# Altium project Alaska 2-1.PrjPcb
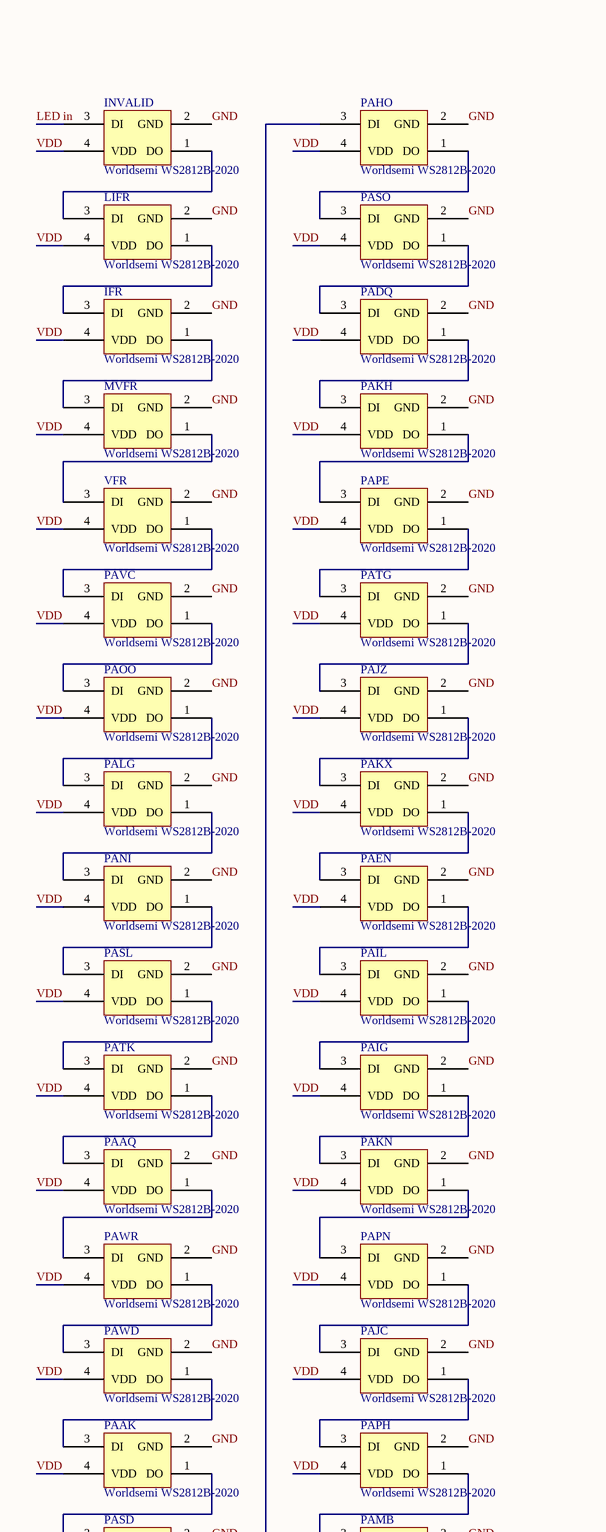
[diagram p0: Alaska 2-1.SchDoc, top left]
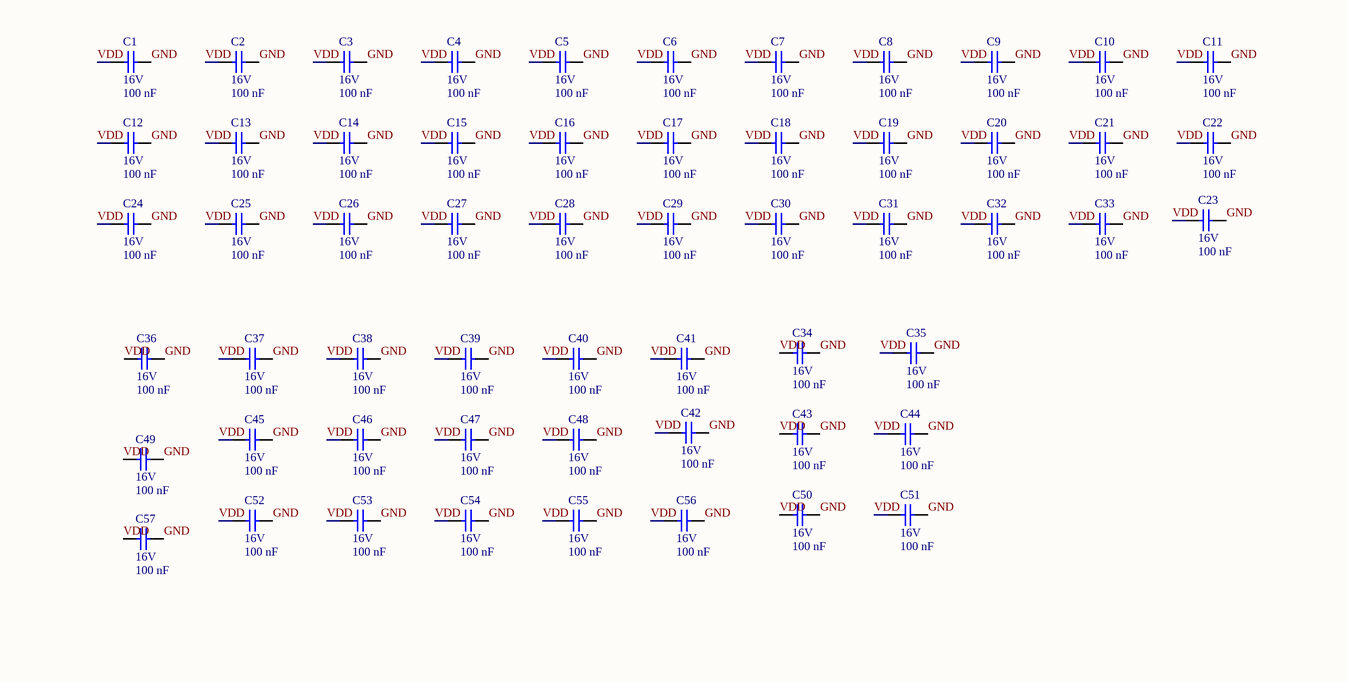
[diagram p1: Alaska 2-1.SchDoc, top middle]
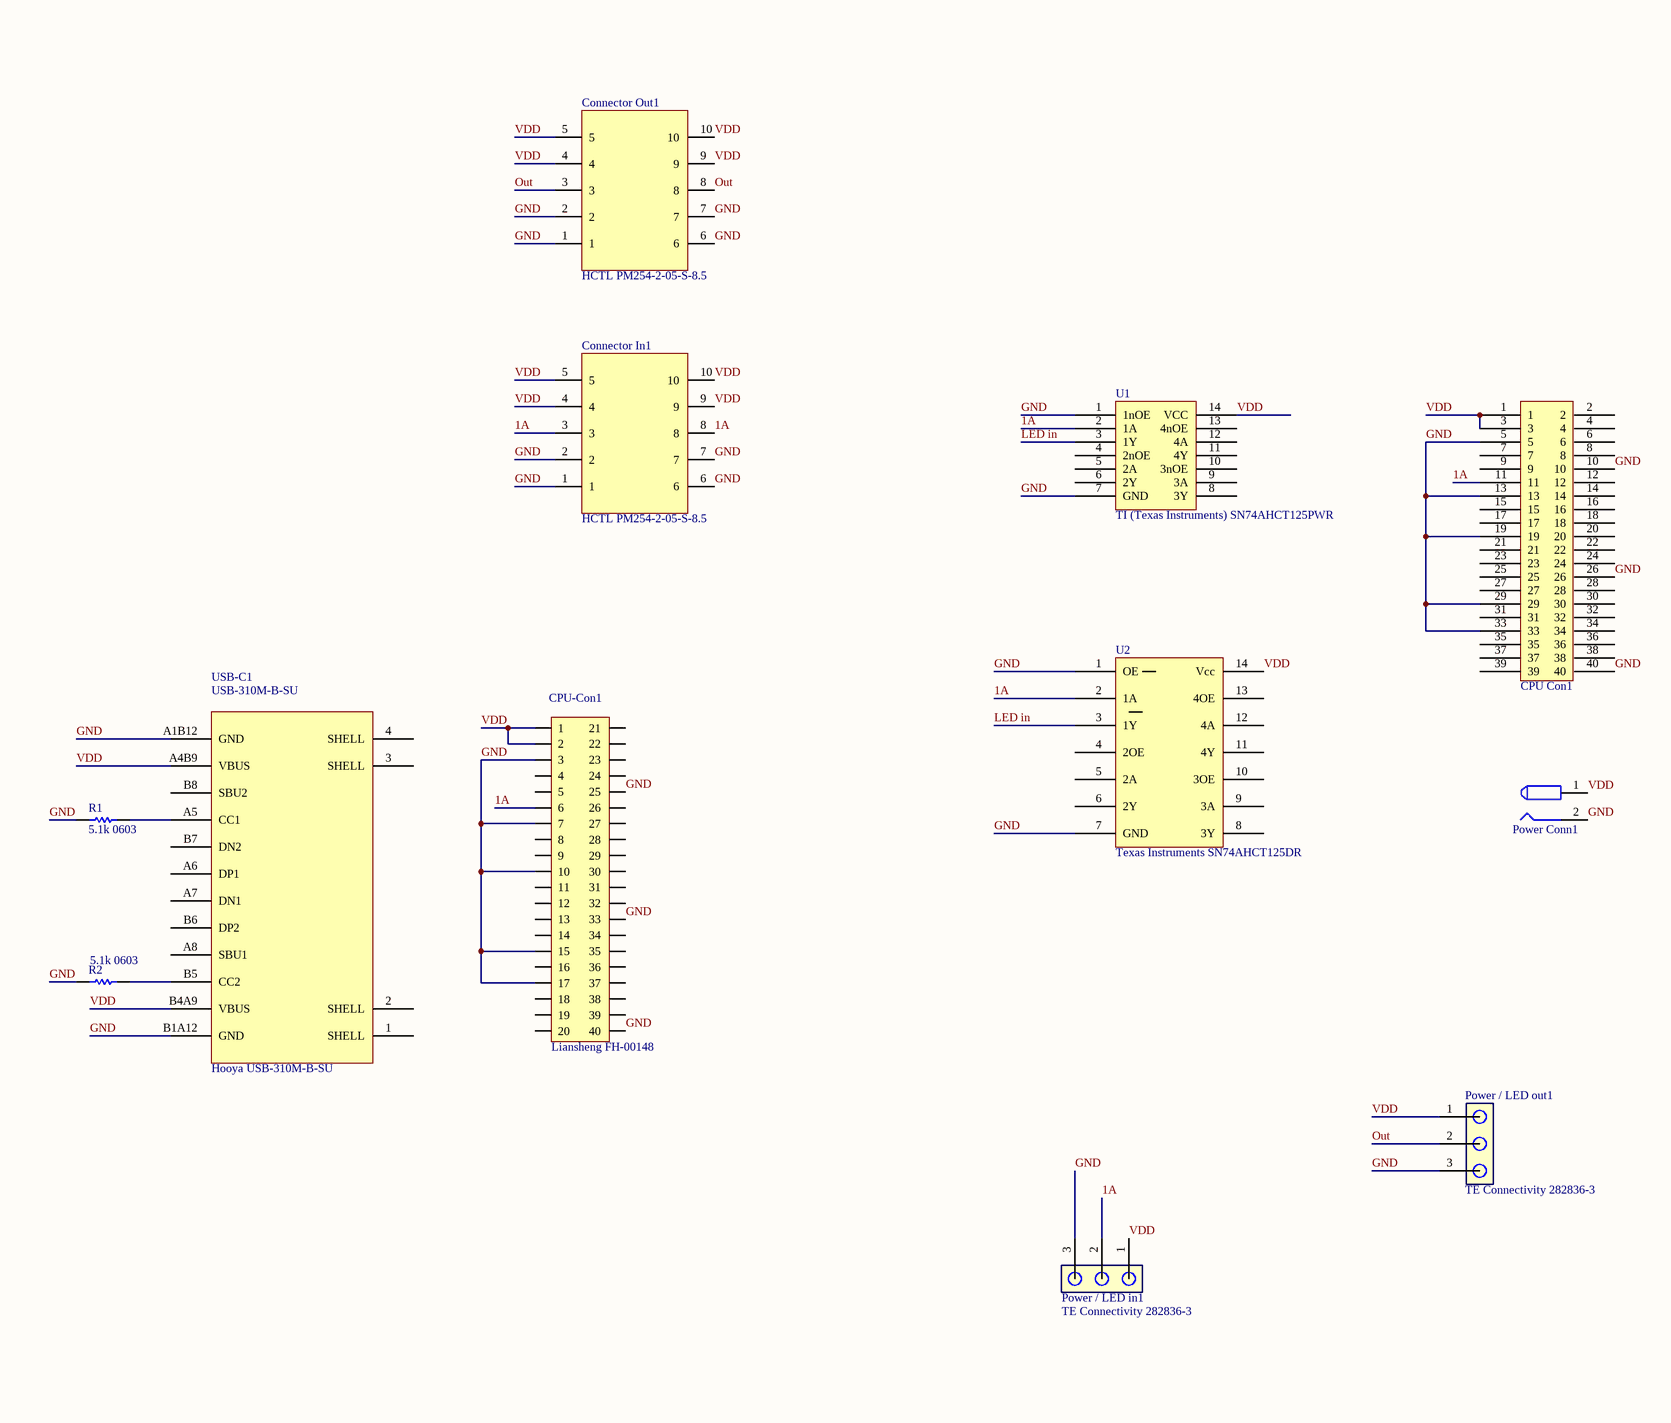
[diagram p2: Alaska 2-1.SchDoc, top right]
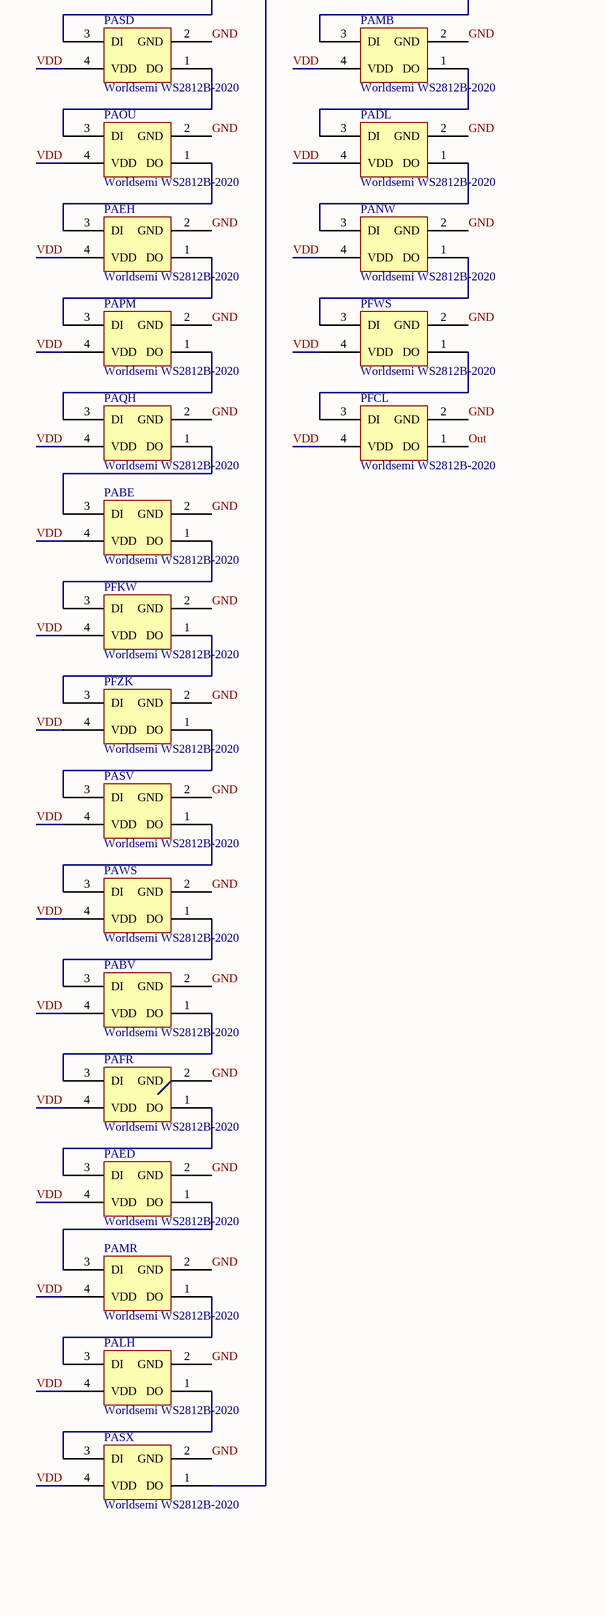
[diagram p3: Alaska 2-1.SchDoc, bottom left]
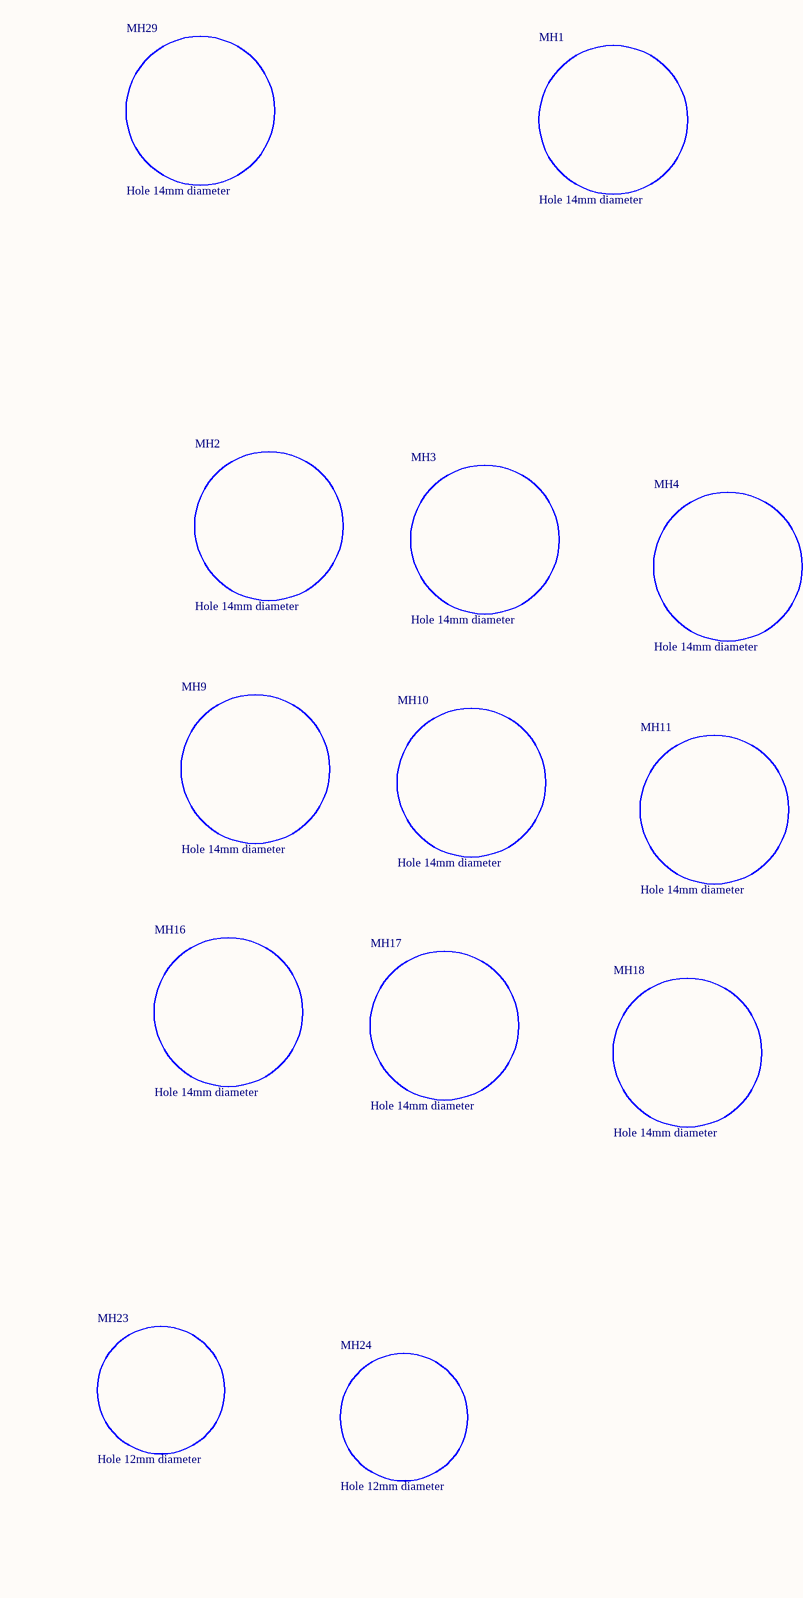
[diagram p4: Alaska 2-1.SchDoc, bottom middle]
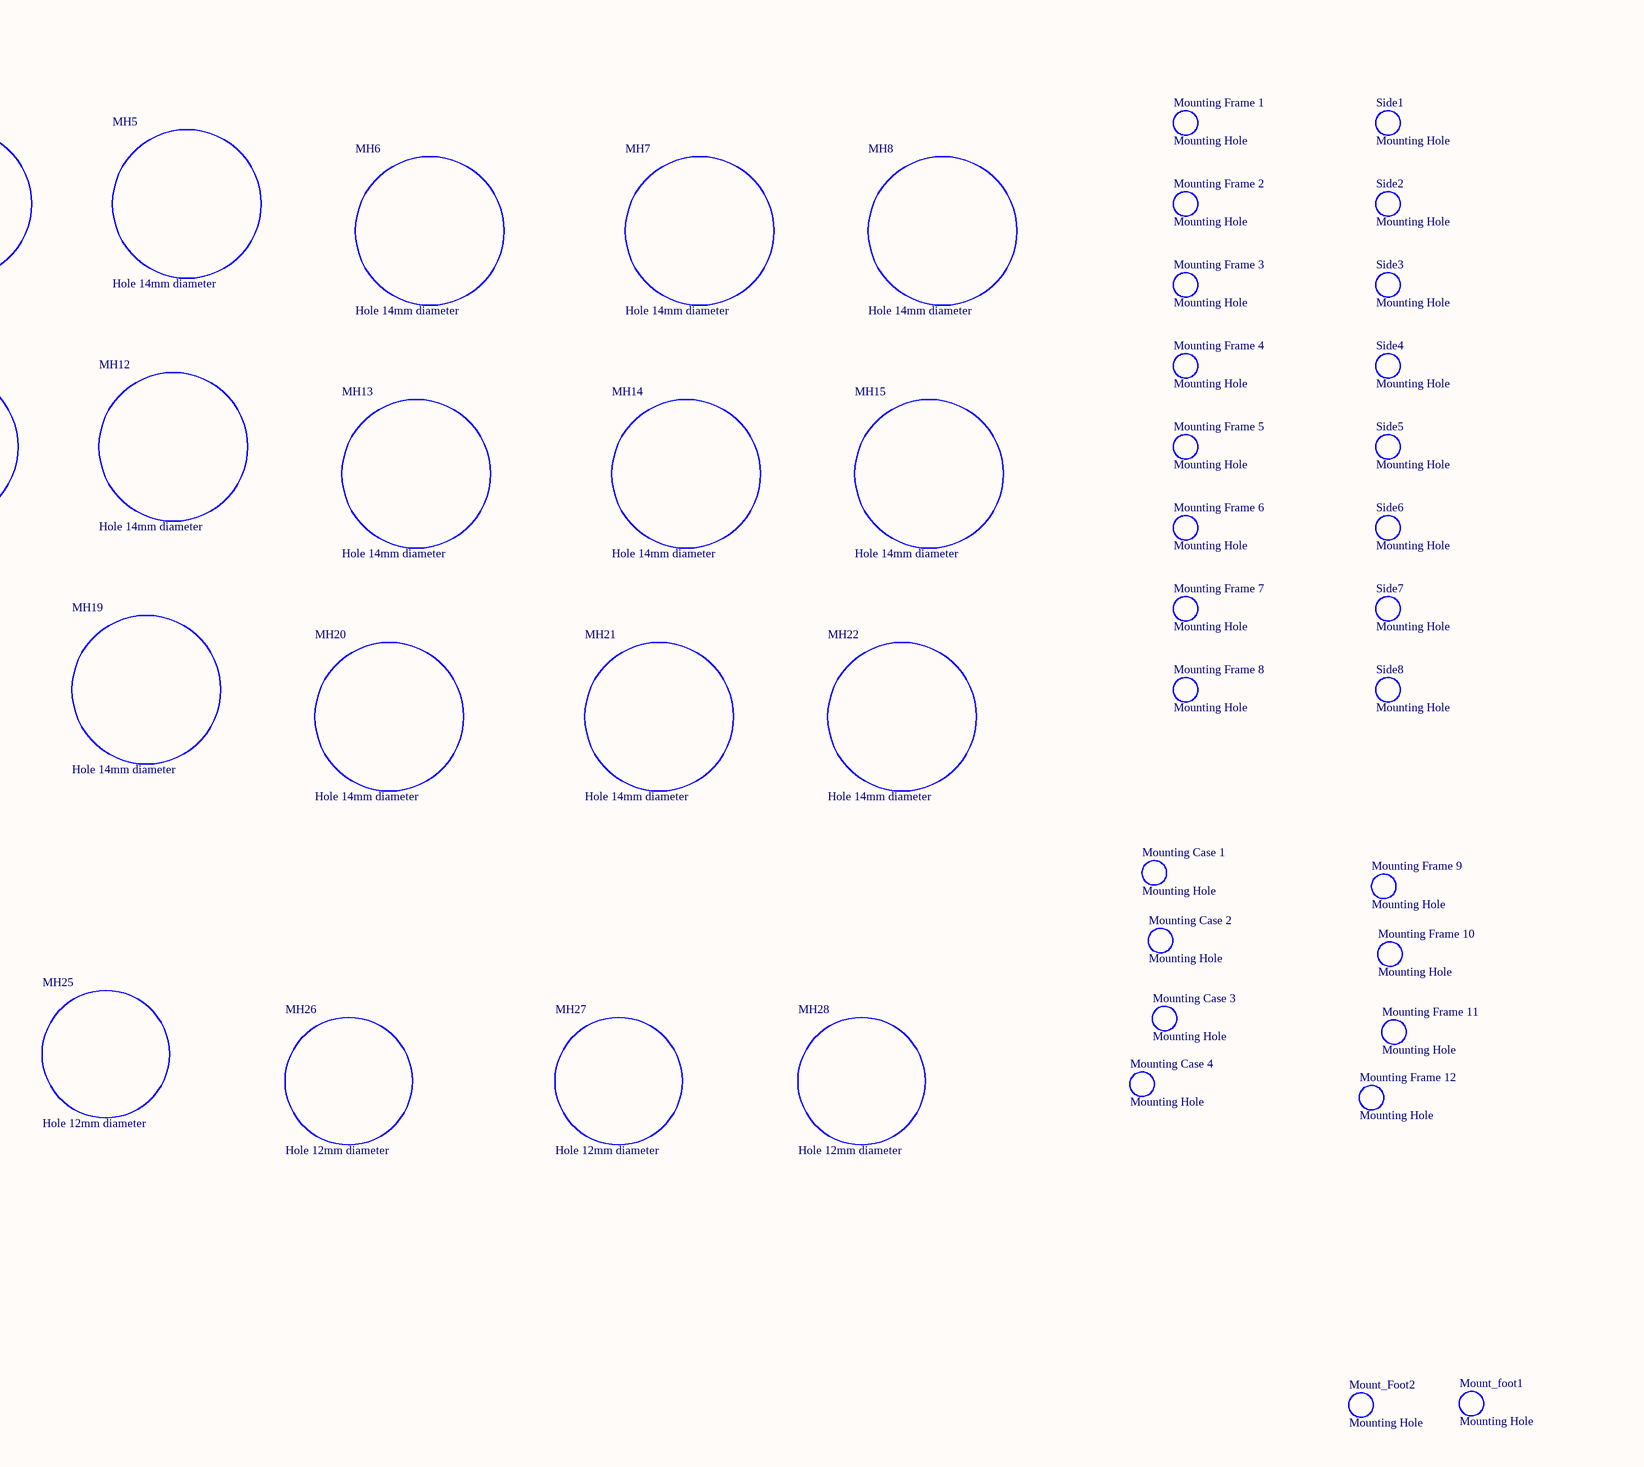
[diagram p5: Alaska 2-1.SchDoc, bottom right]
1 sheet, 175 parts. Net scope: global (net labels, ports and power ports of the same name join across sheets).
Board file: Alaska 2-1.PcbDoc

## Sheet Alaska 2-1.SchDoc
size A0; SheetNumber: 1; SheetTotal: 1

### Parts
C1  16V  Capacitance: 100 nF  [CAPC1005X56X25NL10T15]
C2  16V  Capacitance: 100 nF  [CAPC1005X56X25NL10T15]
C3  16V  Capacitance: 100 nF  [CAPC1005X56X25NL10T15]
C4  16V  Capacitance: 100 nF  [CAPC1005X56X25NL10T15]
C5  16V  Capacitance: 100 nF  [CAPC1005X56X25NL10T15]
C6  16V  Capacitance: 100 nF  [CAPC1005X56X25NL10T15]
C7  16V  Capacitance: 100 nF  [CAPC1005X56X25NL10T15]
C8  16V  Capacitance: 100 nF  [CAPC1005X56X25NL10T15]
C9  16V  Capacitance: 100 nF  [CAPC1005X56X25NL10T15]
C10  16V  Capacitance: 100 nF  [CAPC1005X56X25NL10T15]
C11  16V  Capacitance: 100 nF  [CAPC1005X56X25NL10T15]
C12  16V  Capacitance: 100 nF  [CAPC1005X56X25NL10T15]
C13  16V  Capacitance: 100 nF  [CAPC1005X56X25NL10T15]
C14  16V  Capacitance: 100 nF  [CAPC1005X56X25NL10T15]
C15  16V  Capacitance: 100 nF  [CAPC1005X56X25NL10T15]
C16  16V  Capacitance: 100 nF  [CAPC1005X56X25NL10T15]
C17  16V  Capacitance: 100 nF  [CAPC1005X56X25NL10T15]
C18  16V  Capacitance: 100 nF  [CAPC1005X56X25NL10T15]
C19  16V  Capacitance: 100 nF  [CAPC1005X56X25NL10T15]
C20  16V  Capacitance: 100 nF  [CAPC1005X56X25NL10T15]
C21  16V  Capacitance: 100 nF  [CAPC1005X56X25NL10T15]
C22  16V  Capacitance: 100 nF  [CAPC1005X56X25NL10T15]
C23  16V  Capacitance: 100 nF  [CAPC1005X56X25NL10T15]
C24  16V  Capacitance: 100 nF  [CAPC1005X56X25NL10T15]
C25  16V  Capacitance: 100 nF  [CAPC1005X56X25NL10T15]
C26  16V  Capacitance: 100 nF  [CAPC1005X56X25NL10T15]
C27  16V  Capacitance: 100 nF  [CAPC1005X56X25NL10T15]
C28  16V  Capacitance: 100 nF  [CAPC1005X56X25NL10T15]
C29  16V  Capacitance: 100 nF  [CAPC1005X56X25NL10T15]
C30  16V  Capacitance: 100 nF  [CAPC1005X56X25NL10T15]
C31  16V  Capacitance: 100 nF  [CAPC1005X56X25NL10T15]
C32  16V  Capacitance: 100 nF  [CAPC1005X56X25NL10T15]
C33  16V  Capacitance: 100 nF  [CAPC1005X56X25NL10T15]
C34  16V  Capacitance: 100 nF  [CAPC1005X56X25NL10T15]
C35  16V  Capacitance: 100 nF  [CAPC1005X56X25NL10T15]
C36  16V  Capacitance: 100 nF  [CAPC1005X56X25NL10T15]
C37  16V  Capacitance: 100 nF  [CAPC1005X56X25NL10T15]
C38  16V  Capacitance: 100 nF  [CAPC1005X56X25NL10T15]
C39  16V  Capacitance: 100 nF  [CAPC1005X56X25NL10T15]
C40  16V  Capacitance: 100 nF  [CAPC1005X56X25NL10T15]
C41  16V  Capacitance: 100 nF  [CAPC1005X56X25NL10T15]
C42  16V  Capacitance: 100 nF  [CAPC1005X56X25NL10T15]
C43  16V  Capacitance: 100 nF  [CAPC1005X56X25NL10T15]
C44  16V  Capacitance: 100 nF  [CAPC1005X56X25NL10T15]
C45  16V  Capacitance: 100 nF  [CAPC1005X56X25NL10T15]
C46  16V  Capacitance: 100 nF  [CAPC1005X56X25NL10T15]
C47  16V  Capacitance: 100 nF  [CAPC1005X56X25NL10T15]
C48  16V  Capacitance: 100 nF  [CAPC1005X56X25NL10T15]
C49  16V  Capacitance: 100 nF  [CAPC1005X56X25NL10T15]
C50  16V  Capacitance: 100 nF  [CAPC1005X56X25NL10T15]
C51  16V  Capacitance: 100 nF  [CAPC1005X56X25NL10T15]
C52  16V  Capacitance: 100 nF  [CAPC1005X56X25NL10T15]
C53  16V  Capacitance: 100 nF  [CAPC1005X56X25NL10T15]
C54  16V  Capacitance: 100 nF  [CAPC1005X56X25NL10T15]
C55  16V  Capacitance: 100 nF  [CAPC1005X56X25NL10T15]
C56  16V  Capacitance: 100 nF  [CAPC1005X56X25NL10T15]
C57  16V  Capacitance: 100 nF  [CAPC1005X56X25NL10T15]
Connector_In1  HCTL PM254-2-05-S-8.5  [PM254-2-05-S-8.5]
Connector_Out1  HCTL PM254-2-05-S-8.5  [PM254-2-05-S-8.5]
CPU-Con1  Liansheng FH-00148  [Liansheng_FH-00148_Footprint_01]
CPU_Con1  40 pin Female connector  [Harwin 40 pin Female]  (value not drawn)
IFR  Worldsemi WS2812B-2020  [PCB-18681qzhn4j348g96a9l-1]
INVALID  Worldsemi WS2812B-2020  [PCB-18681qzhn4j348g96a9l-1]
LIFR  Worldsemi WS2812B-2020  [PCB-18681qzhn4j348g96a9l-1]
MH1  Hole 14mm diameter  [Mounting Hole 14mm]
MH2  Hole 14mm diameter  [Mounting Hole 14mm]
MH3  Hole 14mm diameter  [Mounting Hole 14mm]
MH4  Hole 14mm diameter  [Mounting Hole 14mm]
MH5  Hole 14mm diameter  [Mounting Hole 14mm]
MH6  Hole 14mm diameter  [Mounting Hole 14mm]
MH7  Hole 14mm diameter  [Mounting Hole 14mm]
MH8  Hole 14mm diameter  [Mounting Hole 14mm]
MH9  Hole 14mm diameter  [Mounting Hole 14mm]
MH10  Hole 14mm diameter  [Mounting Hole 14mm]
MH11  Hole 14mm diameter  [Mounting Hole 14mm]
MH12  Hole 14mm diameter  [Mounting Hole 14mm]
MH13  Hole 14mm diameter  [Mounting Hole 14mm]
MH14  Hole 14mm diameter  [Mounting Hole 14mm]
MH15  Hole 14mm diameter  [Mounting Hole 14mm]
MH16  Hole 14mm diameter  [Mounting Hole 14mm]
MH17  Hole 14mm diameter  [Mounting Hole 14mm]
MH18  Hole 14mm diameter  [Mounting Hole 14mm]
MH19  Hole 14mm diameter  [Mounting Hole 14mm]
MH20  Hole 14mm diameter  [Mounting Hole 14mm]
MH21  Hole 14mm diameter  [Mounting Hole 14mm]
MH22  Hole 14mm diameter  [Mounting Hole 14mm]
MH23  Hole 12mm diameter  [Mounting Hole 12mm]
MH24  Hole 12mm diameter  [Mounting Hole 12mm]
MH25  Hole 12mm diameter  [Mounting Hole 12mm]
MH26  Hole 12mm diameter  [Mounting Hole 12mm]
MH27  Hole 12mm diameter  [Mounting Hole 12mm]
MH28  Hole 12mm diameter  [Mounting Hole 12mm]
MH29  Hole 14mm diameter  [Mounting Hole 14mm]
Mount_foot1  Mounting Hole  [PCB-q0vxx67e01kaxtvhakkm-1]
Mount_Foot2  Mounting Hole  [PCB-q0vxx67e01kaxtvhakkm-1]
Mounting_Case_1  Mounting Hole  [PCB-q0vxx67e01kaxtvhakkm-1]
Mounting_Case_2  Mounting Hole  [PCB-q0vxx67e01kaxtvhakkm-1]
Mounting_Case_3  Mounting Hole  [PCB-q0vxx67e01kaxtvhakkm-1]
Mounting_Case_4  Mounting Hole  [PCB-q0vxx67e01kaxtvhakkm-1]
Mounting_Frame_1  Mounting Hole  [PCB-q0vxx67e01kaxtvhakkm-1]
Mounting_Frame_2  Mounting Hole  [PCB-q0vxx67e01kaxtvhakkm-1]
Mounting_Frame_3  Mounting Hole  [PCB-q0vxx67e01kaxtvhakkm-1]
Mounting_Frame_4  Mounting Hole  [PCB-q0vxx67e01kaxtvhakkm-1]
Mounting_Frame_5  Mounting Hole  [PCB-q0vxx67e01kaxtvhakkm-1]
Mounting_Frame_6  Mounting Hole  [PCB-q0vxx67e01kaxtvhakkm-1]
Mounting_Frame_7  Mounting Hole  [PCB-q0vxx67e01kaxtvhakkm-1]
Mounting_Frame_8  Mounting Hole  [PCB-q0vxx67e01kaxtvhakkm-1]
Mounting_Frame_9  Mounting Hole  [PCB-q0vxx67e01kaxtvhakkm-1]
Mounting_Frame_10  Mounting Hole  [PCB-q0vxx67e01kaxtvhakkm-1]
Mounting_Frame_11  Mounting Hole  [PCB-q0vxx67e01kaxtvhakkm-1]
Mounting_Frame_12  Mounting Hole  [PCB-q0vxx67e01kaxtvhakkm-1]
MVFR  Worldsemi WS2812B-2020  [PCB-18681qzhn4j348g96a9l-1]
PAAK  Worldsemi WS2812B-2020  [PCB-18681qzhn4j348g96a9l-1]
PAAQ  Worldsemi WS2812B-2020  [PCB-18681qzhn4j348g96a9l-1]
PABE  Worldsemi WS2812B-2020  [PCB-18681qzhn4j348g96a9l-1]
PABV  Worldsemi WS2812B-2020  [PCB-18681qzhn4j348g96a9l-1]
PADL  Worldsemi WS2812B-2020  [PCB-18681qzhn4j348g96a9l-1]
PADQ  Worldsemi WS2812B-2020  [PCB-18681qzhn4j348g96a9l-1]
PAED  Worldsemi WS2812B-2020  [PCB-18681qzhn4j348g96a9l-1]
PAEH  Worldsemi WS2812B-2020  [PCB-18681qzhn4j348g96a9l-1]
PAEN  Worldsemi WS2812B-2020  [PCB-18681qzhn4j348g96a9l-1]
PAFR  Worldsemi WS2812B-2020  [PCB-18681qzhn4j348g96a9l-1]
PAHO  Worldsemi WS2812B-2020  [PCB-18681qzhn4j348g96a9l-1]
PAIG  Worldsemi WS2812B-2020  [PCB-18681qzhn4j348g96a9l-1]
PAIL  Worldsemi WS2812B-2020  [PCB-18681qzhn4j348g96a9l-1]
PAJC  Worldsemi WS2812B-2020  [PCB-18681qzhn4j348g96a9l-1]
PAJZ  Worldsemi WS2812B-2020  [PCB-18681qzhn4j348g96a9l-1]
PAKH  Worldsemi WS2812B-2020  [PCB-18681qzhn4j348g96a9l-1]
PAKN  Worldsemi WS2812B-2020  [PCB-18681qzhn4j348g96a9l-1]
PAKX  Worldsemi WS2812B-2020  [PCB-18681qzhn4j348g96a9l-1]
PALG  Worldsemi WS2812B-2020  [PCB-18681qzhn4j348g96a9l-1]
PALH  Worldsemi WS2812B-2020  [PCB-18681qzhn4j348g96a9l-1]
PAMB  Worldsemi WS2812B-2020  [PCB-18681qzhn4j348g96a9l-1]
PAMR  Worldsemi WS2812B-2020  [PCB-18681qzhn4j348g96a9l-1]
PANI  Worldsemi WS2812B-2020  [PCB-18681qzhn4j348g96a9l-1]
PANW  Worldsemi WS2812B-2020  [PCB-18681qzhn4j348g96a9l-1]
PAOO  Worldsemi WS2812B-2020  [PCB-18681qzhn4j348g96a9l-1]
PAOU  Worldsemi WS2812B-2020  [PCB-18681qzhn4j348g96a9l-1]
PAPE  Worldsemi WS2812B-2020  [PCB-18681qzhn4j348g96a9l-1]
PAPH  Worldsemi WS2812B-2020  [PCB-18681qzhn4j348g96a9l-1]
PAPM  Worldsemi WS2812B-2020  [PCB-18681qzhn4j348g96a9l-1]
PAPN  Worldsemi WS2812B-2020  [PCB-18681qzhn4j348g96a9l-1]
PAQH  Worldsemi WS2812B-2020  [PCB-18681qzhn4j348g96a9l-1]
PASD  Worldsemi WS2812B-2020  [PCB-18681qzhn4j348g96a9l-1]
PASL  Worldsemi WS2812B-2020  [PCB-18681qzhn4j348g96a9l-1]
PASO  Worldsemi WS2812B-2020  [PCB-18681qzhn4j348g96a9l-1]
PASV  Worldsemi WS2812B-2020  [PCB-18681qzhn4j348g96a9l-1]
PASX  Worldsemi WS2812B-2020  [PCB-18681qzhn4j348g96a9l-1]
PATG  Worldsemi WS2812B-2020  [PCB-18681qzhn4j348g96a9l-1]
PATK  Worldsemi WS2812B-2020  [PCB-18681qzhn4j348g96a9l-1]
PAVC  Worldsemi WS2812B-2020  [PCB-18681qzhn4j348g96a9l-1]
PAWD  Worldsemi WS2812B-2020  [PCB-18681qzhn4j348g96a9l-1]
PAWR  Worldsemi WS2812B-2020  [PCB-18681qzhn4j348g96a9l-1]
PAWS  Worldsemi WS2812B-2020  [PCB-18681qzhn4j348g96a9l-1]
PFCL  Worldsemi WS2812B-2020  [PCB-18681qzhn4j348g96a9l-1]
PFKW  Worldsemi WS2812B-2020  [PCB-18681qzhn4j348g96a9l-1]
PFWS  Worldsemi WS2812B-2020  [PCB-18681qzhn4j348g96a9l-1]
PFZK  Worldsemi WS2812B-2020  [PCB-18681qzhn4j348g96a9l-1]
Power_/_LED_in1  TE Connectivity 282836-3  [282836-3]
Power_/_LED_out1  TE Connectivity 282836-3  [282836-3]
Power_Conn1  CMP-330397-12  [PCB-h5dulpljww4oyv25n50t-1]  (value not drawn)
R1  5.1k 0603  [CAPC1608X90X35NL15T15]
R2  5.1k 0603  [CAPC1608X90X35NL15T15]
Side1  Mounting Hole  [PCB-q0vxx67e01kaxtvhakkm-1]
Side2  Mounting Hole  [PCB-q0vxx67e01kaxtvhakkm-1]
Side3  Mounting Hole  [PCB-q0vxx67e01kaxtvhakkm-1]
Side4  Mounting Hole  [PCB-q0vxx67e01kaxtvhakkm-1]
Side5  Mounting Hole  [PCB-q0vxx67e01kaxtvhakkm-1]
Side6  Mounting Hole  [PCB-q0vxx67e01kaxtvhakkm-1]
Side7  Mounting Hole  [PCB-q0vxx67e01kaxtvhakkm-1]
Side8  Mounting Hole  [PCB-q0vxx67e01kaxtvhakkm-1]
U1  TI (Texas Instruments) SN74AHCT125PWR  [PCB-19361381-1]
U2  Texas Instruments SN74AHCT125DR  [PCB-4n9l8bvb0hxmq9svv09s-1]
USB-C1  Hooya USB-310M-B-SU  [Hooya USB-310M-B-SU-Footprint-1]
VFR  Worldsemi WS2812B-2020  [PCB-18681qzhn4j348g96a9l-1]

### Nets
1A: Connector_In1.3 Connector_In1.8 CPU-Con1.6 CPU_Con1.11 Power_/_LED_in1.2 U1.2(1A) U2.2(1A)
GND: C1.2 C2.2 C3.2 C4.2 C5.2 C6.2 C7.2 C8.2 C9.2 C10.2 C11.2 C12.2 C13.2 C14.2 C15.2 C16.2 C17.2 C18.2 C19.2 C20.2 C21.2 C22.2 C23.2 C24.2 C25.2 C26.2 C27.2 C28.2 C29.2 C30.2 C31.2 C32.2 C33.2 C34.2 C35.2 C36.2 C37.2 C38.2 C39.2 C40.2 C41.2 C42.2 C43.2 C44.2 C45.2 C46.2 C47.2 C48.2 C49.2 C50.2 C51.2 C52.2 C53.2 C54.2 C55.2 C56.2 C57.2 Connector_In1.1 Connector_In1.2 Connector_In1.6 Connector_In1.7 Connector_Out1.1 Connector_Out1.2 Connector_Out1.6 Connector_Out1.7 CPU-Con1.3 CPU-Con1.7 CPU-Con1.10 CPU-Con1.15 CPU-Con1.17 CPU-Con1.25 CPU-Con1.33 CPU-Con1.40 CPU_Con1.5 CPU_Con1.10 CPU_Con1.13 CPU_Con1.19 CPU_Con1.26 CPU_Con1.29 CPU_Con1.33 CPU_Con1.40 IFR.2(GND) INVALID.2(GND) LIFR.2(GND) MVFR.2(GND) PAAK.2(GND) PAAQ.2(GND) PABE.2(GND) PABV.2(GND) PADL.2(GND) PADQ.2(GND) PAED.2(GND) PAEH.2(GND) PAEN.2(GND) PAFR.2(GND) PAHO.2(GND) PAIG.2(GND) PAIL.2(GND) PAJC.2(GND) PAJZ.2(GND) PAKH.2(GND) PAKN.2(GND) PAKX.2(GND) PALG.2(GND) PALH.2(GND) PAMB.2(GND) PAMR.2(GND) PANI.2(GND) PANW.2(GND) PAOO.2(GND) PAOU.2(GND) PAPE.2(GND) PAPH.2(GND) PAPM.2(GND) PAPN.2(GND) PAQH.2(GND) PASD.2(GND) PASL.2(GND) PASO.2(GND) PASV.2(GND) PASX.2(GND) PATG.2(GND) PATK.2(GND) PAVC.2(GND) PAWD.2(GND) PAWR.2(GND) PAWS.2(GND) PFCL.2(GND) PFKW.2(GND) PFWS.2(GND) PFZK.2(GND) Power_/_LED_in1.3 Power_/_LED_out1.3 Power_Conn1.2(NEG) R1.1 R2.1 U1.1(1nOE) U1.7(GND) U2.1(OE) U2.7(GND) USB-C1.A1B12(GND) USB-C1.B1A12(GND) VFR.2(GND)
LED in: INVALID.3(DI) U1.3(1Y) U2.3(1Y)
Out: Connector_Out1.3 Connector_Out1.8 PFCL.1(DO) Power_/_LED_out1.2
VDD: C1.1 C2.1 C3.1 C4.1 C5.1 C6.1 C7.1 C8.1 C9.1 C10.1 C11.1 C12.1 C13.1 C14.1 C15.1 C16.1 C17.1 C18.1 C19.1 C20.1 C21.1 C22.1 C23.1 C24.1 C25.1 C26.1 C27.1 C28.1 C29.1 C30.1 C31.1 C32.1 C33.1 C34.1 C35.1 C36.1 C37.1 C38.1 C39.1 C40.1 C41.1 C42.1 C43.1 C44.1 C45.1 C46.1 C47.1 C48.1 C49.1 C50.1 C51.1 C52.1 C53.1 C54.1 C55.1 C56.1 C57.1 Connector_In1.4 Connector_In1.5 Connector_In1.9 Connector_In1.10 Connector_Out1.4 Connector_Out1.5 Connector_Out1.9 Connector_Out1.10 CPU-Con1.1 CPU-Con1.2 CPU_Con1.1 CPU_Con1.3 IFR.4(VDD) INVALID.4(VDD) LIFR.4(VDD) MVFR.4(VDD) PAAK.4(VDD) PAAQ.4(VDD) PABE.4(VDD) PABV.4(VDD) PADL.4(VDD) PADQ.4(VDD) PAED.4(VDD) PAEH.4(VDD) PAEN.4(VDD) PAFR.4(VDD) PAHO.4(VDD) PAIG.4(VDD) PAIL.4(VDD) PAJC.4(VDD) PAJZ.4(VDD) PAKH.4(VDD) PAKN.4(VDD) PAKX.4(VDD) PALG.4(VDD) PALH.4(VDD) PAMB.4(VDD) PAMR.4(VDD) PANI.4(VDD) PANW.4(VDD) PAOO.4(VDD) PAOU.4(VDD) PAPE.4(VDD) PAPH.4(VDD) PAPM.4(VDD) PAPN.4(VDD) PAQH.4(VDD) PASD.4(VDD) PASL.4(VDD) PASO.4(VDD) PASV.4(VDD) PASX.4(VDD) PATG.4(VDD) PATK.4(VDD) PAVC.4(VDD) PAWD.4(VDD) PAWR.4(VDD) PAWS.4(VDD) PFCL.4(VDD) PFKW.4(VDD) PFWS.4(VDD) PFZK.4(VDD) Power_/_LED_in1.1 Power_/_LED_out1.1 Power_Conn1.1(POS) U1.14(VCC) U2.14(Vcc) USB-C1.A4B9(VBUS) USB-C1.B4A9(VBUS) VFR.4(VDD)
NetIFR_1: IFR.1(DO) MVFR.3(DI)
NetIFR_3: IFR.3(DI) LIFR.1(DO)
NetINVALID_1: INVALID.1(DO) LIFR.3(DI)
NetMVFR_1: MVFR.1(DO) VFR.3(DI)
NetPAAK_1: PAAK.1(DO) PASD.3(DI)
NetPAAK_3: PAAK.3(DI) PAWD.1(DO)
NetPAAQ_1: PAAQ.1(DO) PAWR.3(DI)
NetPAAQ_3: PAAQ.3(DI) PATK.1(DO)
NetPABE_1: PABE.1(DO) PFKW.3(DI)
NetPABE_3: PABE.3(DI) PAQH.1(DO)
NetPABV_1: PABV.1(DO) PAFR.3(DI)
NetPABV_3: PABV.3(DI) PAWS.1(DO)
NetPADL_1: PADL.1(DO) PANW.3(DI)
NetPADL_3: PADL.3(DI) PAMB.1(DO)
NetPADQ_1: PADQ.1(DO) PAKH.3(DI)
NetPADQ_3: PADQ.3(DI) PASO.1(DO)
NetPAED_1: PAED.1(DO) PAMR.3(DI)
NetPAED_3: PAED.3(DI) PAFR.1(DO)
NetPAEH_1: PAEH.1(DO) PAPM.3(DI)
NetPAEH_3: PAEH.3(DI) PAOU.1(DO)
NetPAEN_1: PAEN.1(DO) PAIL.3(DI)
NetPAEN_3: PAEN.3(DI) PAKX.1(DO)
NetPAHO_1: PAHO.1(DO) PASO.3(DI)
NetPAHO_3: PAHO.3(DI) PASX.1(DO)
NetPAIG_1: PAIG.1(DO) PAKN.3(DI)
NetPAIG_3: PAIG.3(DI) PAIL.1(DO)
NetPAJC_1: PAJC.1(DO) PAPH.3(DI)
NetPAJC_3: PAJC.3(DI) PAPN.1(DO)
NetPAJZ_1: PAJZ.1(DO) PAKX.3(DI)
NetPAJZ_3: PAJZ.3(DI) PATG.1(DO)
NetPAKH_1: PAKH.1(DO) PAPE.3(DI)
NetPAKN_1: PAKN.1(DO) PAPN.3(DI)
NetPALG_1: PALG.1(DO) PANI.3(DI)
NetPALG_3: PALG.3(DI) PAOO.1(DO)
NetPALH_1: PALH.1(DO) PASX.3(DI)
NetPALH_3: PALH.3(DI) PAMR.1(DO)
NetPAMB_3: PAMB.3(DI) PAPH.1(DO)
NetPANI_1: PANI.1(DO) PASL.3(DI)
NetPANW_1: PANW.1(DO) PFWS.3(DI)
NetPAOO_3: PAOO.3(DI) PAVC.1(DO)
NetPAOU_3: PAOU.3(DI) PASD.1(DO)
NetPAPE_1: PAPE.1(DO) PATG.3(DI)
NetPAPM_1: PAPM.1(DO) PAQH.3(DI)
NetPASL_1: PASL.1(DO) PATK.3(DI)
NetPASV_1: PASV.1(DO) PAWS.3(DI)
NetPASV_3: PASV.3(DI) PFZK.1(DO)
NetPAVC_3: PAVC.3(DI) VFR.1(DO)
NetPAWD_3: PAWD.3(DI) PAWR.1(DO)
NetPFCL_3: PFCL.3(DI) PFWS.1(DO)
NetPFKW_1: PFKW.1(DO) PFZK.3(DI)
NetR1_2: R1.2 USB-C1.A5(CC1)
NetR2_2: R2.2 USB-C1.B5(CC2)

Not connected (* = marked no-connect by the designer): CPU-Con1 4 5 8 9 11 12 13 14 16 18 19 20 21 22 23 24 26 27 28 29 30 31 32 34 35 36 37 38 39; CPU_Con1 2 4 6 7 8 9 12 14 15 16 17 18 20 21 22 23 24 25 27 28 30 31 32 34 35 36 37 38 39; U1 4(2nOE) 5(2A) 6(2Y) 8(3Y) 9(3A) 10(3nOE) 11(4Y) 12(4A) 13(4nOE); U2 4(2OE) 5(2A) 6(2Y) 8(3Y) 9(3A) 10(3OE) 11(4Y) 12(4A) 13(4OE); USB-C1 1(SHELL) 2(SHELL) 3(SHELL) 4(SHELL) A6(DP1) A7(DN1) A8(SBU1) B6(DP2) B7(DN2) B8(SBU2)

### Library data of the parts
C1-C57 = CMP-bf2276a55d9a60e5-20: Generic CAP 0402, =Capacitance+','+Tolerance+','+Voltage+','+Dielectric+','+Case; Manufacturer Part Number: TBD; Lead-Free Status: Lead Free; Voltage: 25V; Dielectric: CGO; Tolerance: ±10%; Octopart URL: TBD; Case: 0402; OctopartID: 0755ced2c795d892; RoHS: Compliant; Mounting Style: Surface Mount; Footprint: PCB-0002-00476-3
Connector_In1 Connector_Out1 = PM254-2-05-S-8.5: 2.54mm 2.54mm 260℃@5S 3A -40℃~+105℃ Copper Alloy 10P Brick nogging 2x5P Top 8.5mm Square Hole SMD,P=2.54mm Female Headers ROHS; ComponentLink1Description: New link; ComponentLink1URL: https://www.lcsc.com/product-detail/Female-Headers_HCTL-PM254-2-05-S-8-5_C3975150.html
CPU-Con1 = CMP-xf5hfsu41fuj64nwsg7i-2: 2.54mm 2.54mm 3A Gold Brass -40℃~+105℃ 260℃@10S Brick nogging 2x20P 7.1mm Top 40 Square Holes SMD,P=2.54mm Female Headers ROHS; ComponentLink1Description: Website; ComponentLink1URL: https://www.lcsc.com/product-detail/Female-Headers_Liansheng-FH-00148_C2685092.html; CustomComponentID: xf5hfsu41fuj64nwsg7i
CPU_Con1 = CMP-2482621-16: 2.54mm (0.1") Pitch DIL Vertical PC Tail Socket Assembly, tin, 20+20 contacts
IFR INVALID LIFR MVFR PAAK PAAQ PABE PABV PADL PADQ PAED PAEH PAEN PAFR PAHO PAIG PAIL PAJC PAJZ PAKH PAKN PAKX PALG PALH PAMB PAMR PANI PANW PAOO PAOU PAPE PAPH PAPM PAPN PAQH PASD PASL PASO PASV PASX PATG PATK PAVC PAWD PAWR PAWS PFCL PFKW PFWS PFZK VFR = CMP-30b1feb25fa9ef76-6: Manufacturer Part Number: WS2812B-2020; Octopart URL: https://octopart.com/ws2812b-2020-worldsemi-118049406; OctopartID: 30b1feb25fa9ef76
MH1-MH22 MH29 = Mounting Hole 14mm: Hole for mounting
MH23-MH28 = Mounting Hole 12mm: Hole for mounting
Mount_foot1 Mount_Foot2 Mounting_Case_1-Mounting_Case_4 Mounting_Frame_1-Mounting_Frame_12 Side1-Side8 = CMP-q3gk3wg8yin1w7wp8pag-1: Mounting Hole 3.5mm; CustomComponentID: q3gk3wg8yin1w7wp8pag
Power_/_LED_in1 Power_/_LED_out1 = CMP-d7c21c93a45c0805-15: Conn; Term Blk; Wire Receptacle; 3; 5 mm; 30-16 AWG; Green; 13.5 A; 300 V; Number of Contacts: 3; Lead-Free Status: Lead Free; Pin Pitch: 5.00 mm; Wire Gauge: 15.0 AWG; Voltage Rating (AC): 250 V; Current Rating: 13.5 A; ELV Compliant: Compliant; Octopart URL: http://octopart.com/282836-3-te+connectivity-39540472; Manufacturer Part Number: 282836-3; Housing Material: Nylon 6/6; Housing Color: Green; RoHS: Compliant; Orientation: Right Angle; Mounting Style: PCB; Number of Positions: 3; Insulation Material: Nylon; Flammability Rating: UL 94 V-0; OctopartID: d7c21c93a45c0805; Lifecycle Status: Active; REACH SVHC Compliance: No SVHC; Color: Green; Contact Plating: Tin; Contact Material: Brass
Power_Conn1 = CMP-330397-12: CUI PJ-037A; Shielding: No
R1 R2 = CMP-3656428-4: Res Thick Film 0603 5.1K Ohm 1% 1/10W ±100ppm/°C Molded SMD SMD Punched Carrier T/R; Manufacturer Part Number: ERJ-3EKF5101V; Voltage Rating (DC): 75.0 V; Power Rating: 100 mW; Lead-Free Status: Lead Free; Resistance: 5.1 kΩ; REACH SVHC Compliance: No SVHC; Lifecycle Status: Not Listed by Manufacturer; Packaging: Cut Tape (CT); Mounting Style: Surface Mount; RoHS: Compliant; OctopartID: 45aa8fedcba59a6d; Case/Package: 0603; Octopart URL: http://octopart.com/erj-3ekf5101v-panasonic-55421801; Resistance Tolerance: ±1%
U1 = CMP-13613041-2: IC BUS BUFFER TRI-ST QD 14TSSOP; Lead-Free Status: Lead Free; Number of Bits: 4; Output Current Drive: -0.001 A; Propagation Delay Max (tpd): 8.5e-09 s; Voltage Nodes: 5.0 V; Case/Package: TSSOP; Lifecycle Status: Active; Mounting Style: Surface Mount; Number of Circuits: 4; Number of Outputs: 4; Number of Pins: 14; Octopart Url: https://octopart.com/sn74ahct125pwr-texas+instruments-46548606; OctopartID: 822b49e7e1335dec; Packaging: Cut Tape (CT); REACH SVHC Compliance: No SVHC; RoHS: Compliant; Manufacturer Part Number: SN74AHCT125PWR
U2 = CMP-35ebfce60942ea2c-2: Buffer/Line Driver 4-CH Non-Inverting 3-ST CMOS 14-Pin SOIC T/R; Number of Outputs: 4; Voltage Nodes: 5.00 V; Propagation Delay Max (tpd): 8.50 ns; Quiescent Current: 2.00 µA (max); Supply Voltage (DC): 4.50 V to 5.50 V; Output Current Drive: -1.00 mA; Lead-Free Status: Lead Free; Packaging: Tape & Reel (TR); Lifecycle Status: Active; Operating Temperature: -40.0 °C (min); Manufacturer Part Number: SN74AHCT125DR; Case/Package: SOIC-14_3.9x8.7x1.27P; Mounting Style: Surface Mount; OctopartID: 35ebfce60942ea2c; Octopart URL: https://octopart.com/sn74ahct125dr-texas+instruments-465359; RoHS: Compliant; Number of Pins: 14; REACH SVHC Compliance: No SVHC; Number of Circuits: 4; Number of Bits: 4
USB-C1 = CMP-967358be92de49b4-1: 3A 1 Surface Mount 16 Female Type-C SMD USB Connector ROHS; Manufacturer Part Number: USB-310M-B-SU; OctopartID: 967358be92de49b4; Octopart Url: https://octopart.com/usb-310m-b-su-hooya-130490827